# Altium schematic sheet CHARGER.schdoc
size 183 x 103 mm
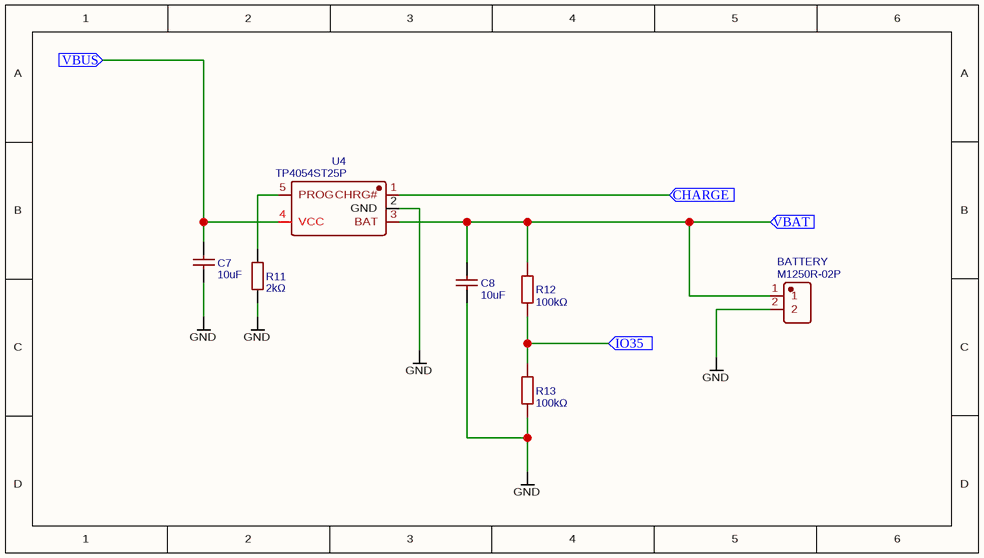
[diagram p0: CHARGER.schdoc]

## Parts
BATTERY  M1250R-02P  [CONN-TH_2P-P1.25_L4.7-W4.3]
C7  10uF  [C0603]
C8  10uF  [C0603]
R11  2kΩ  [R0603]
R12  100kΩ  [R0603]
R13  100kΩ  [R0603]
U4  TP4054ST25P  [SOT-23-5_L2.9-W1.6-P0.95-LS2.8-BL]

## Ports
CHARGE (in), IO35 (in), VBAT (in), VBUS (in)

## Nets
GND: BATTERY.2 C7.1 C8.1 R11.1 R13.1 U4.2(GND)
CHARGE: U4.1(CHRG#) ; port CHARGE
IO35: R12.1 R13.2 ; port IO35
VBAT: BATTERY.1 C8.2 R12.2 U4.3(BAT) ; port VBAT
VBUS: C7.2 U4.4(VCC) ; port VBUS
NetR11_2: R11.2 U4.5(PROG)

## Library data of the parts
BATTERY = M1250R-02P: BOM_Manufacturer: XFCN; Contributor: LCSC; BOM_Supplier: LCSC; BOM_Supplier Part: C481436; BOM_Manufacturer Part: M1250R-02P; BOM_JLCPCB Part Class: Extended Part; spicePre: C; spiceSymbolName: M1250R-02P
C7 C8 = 10uF: BOM_Manufacturer: SAMSUNG; BOM_Manufacturer Part: CL10A106MO8NQNC; nameAlias: Capacitance; BOM_Supplier: LCSC; BOM_Supplier Part: C92487; BOM_JLCPCB Part Class: Extended Part; spicePre: C; spiceSymbolName: CL10A106MO8NQNC
R11 = 2kΩ: BOM_Manufacturer: FH; BOM_Manufacturer Part: RS-03K2001FT; nameAlias: Resistance; Resistance (Ohms): 2K; BOM_Supplier: LCSC; BOM_Supplier Part: C115336; BOM_JLCPCB Part Class: Extended Part; spicePre: R; spiceSymbolName: RS-03K2001FT
R12 R13 = 100kΩ: BOM_Manufacturer: FH; BOM_Manufacturer Part: RS-03K1003FT; Resistance (Ohms): 100K; nameAlias: Resistance; Contributor: LCSC; BOM_Supplier: LCSC; BOM_Supplier Part: C115320; BOM_JLCPCB Part Class: Extended Part; spicePre: R; spiceSymbolName: RS-03K1003FT_C115320
U4 = TP4054ST25P: BOM_Manufacturer: TPOWER; Contributor: LCSC; BOM_Supplier: LCSC; BOM_Supplier Part: C382138; BOM_Manufacturer Part: TP4054ST25P; BOM_JLCPCB Part Class: Extended Part; spicePre: U; spiceSymbolName: TP4054ST25P